# Altium schematic sheet AI_CONN.SchDoc
size C portrait; SheetNumber: 5; SheetTotal: 5
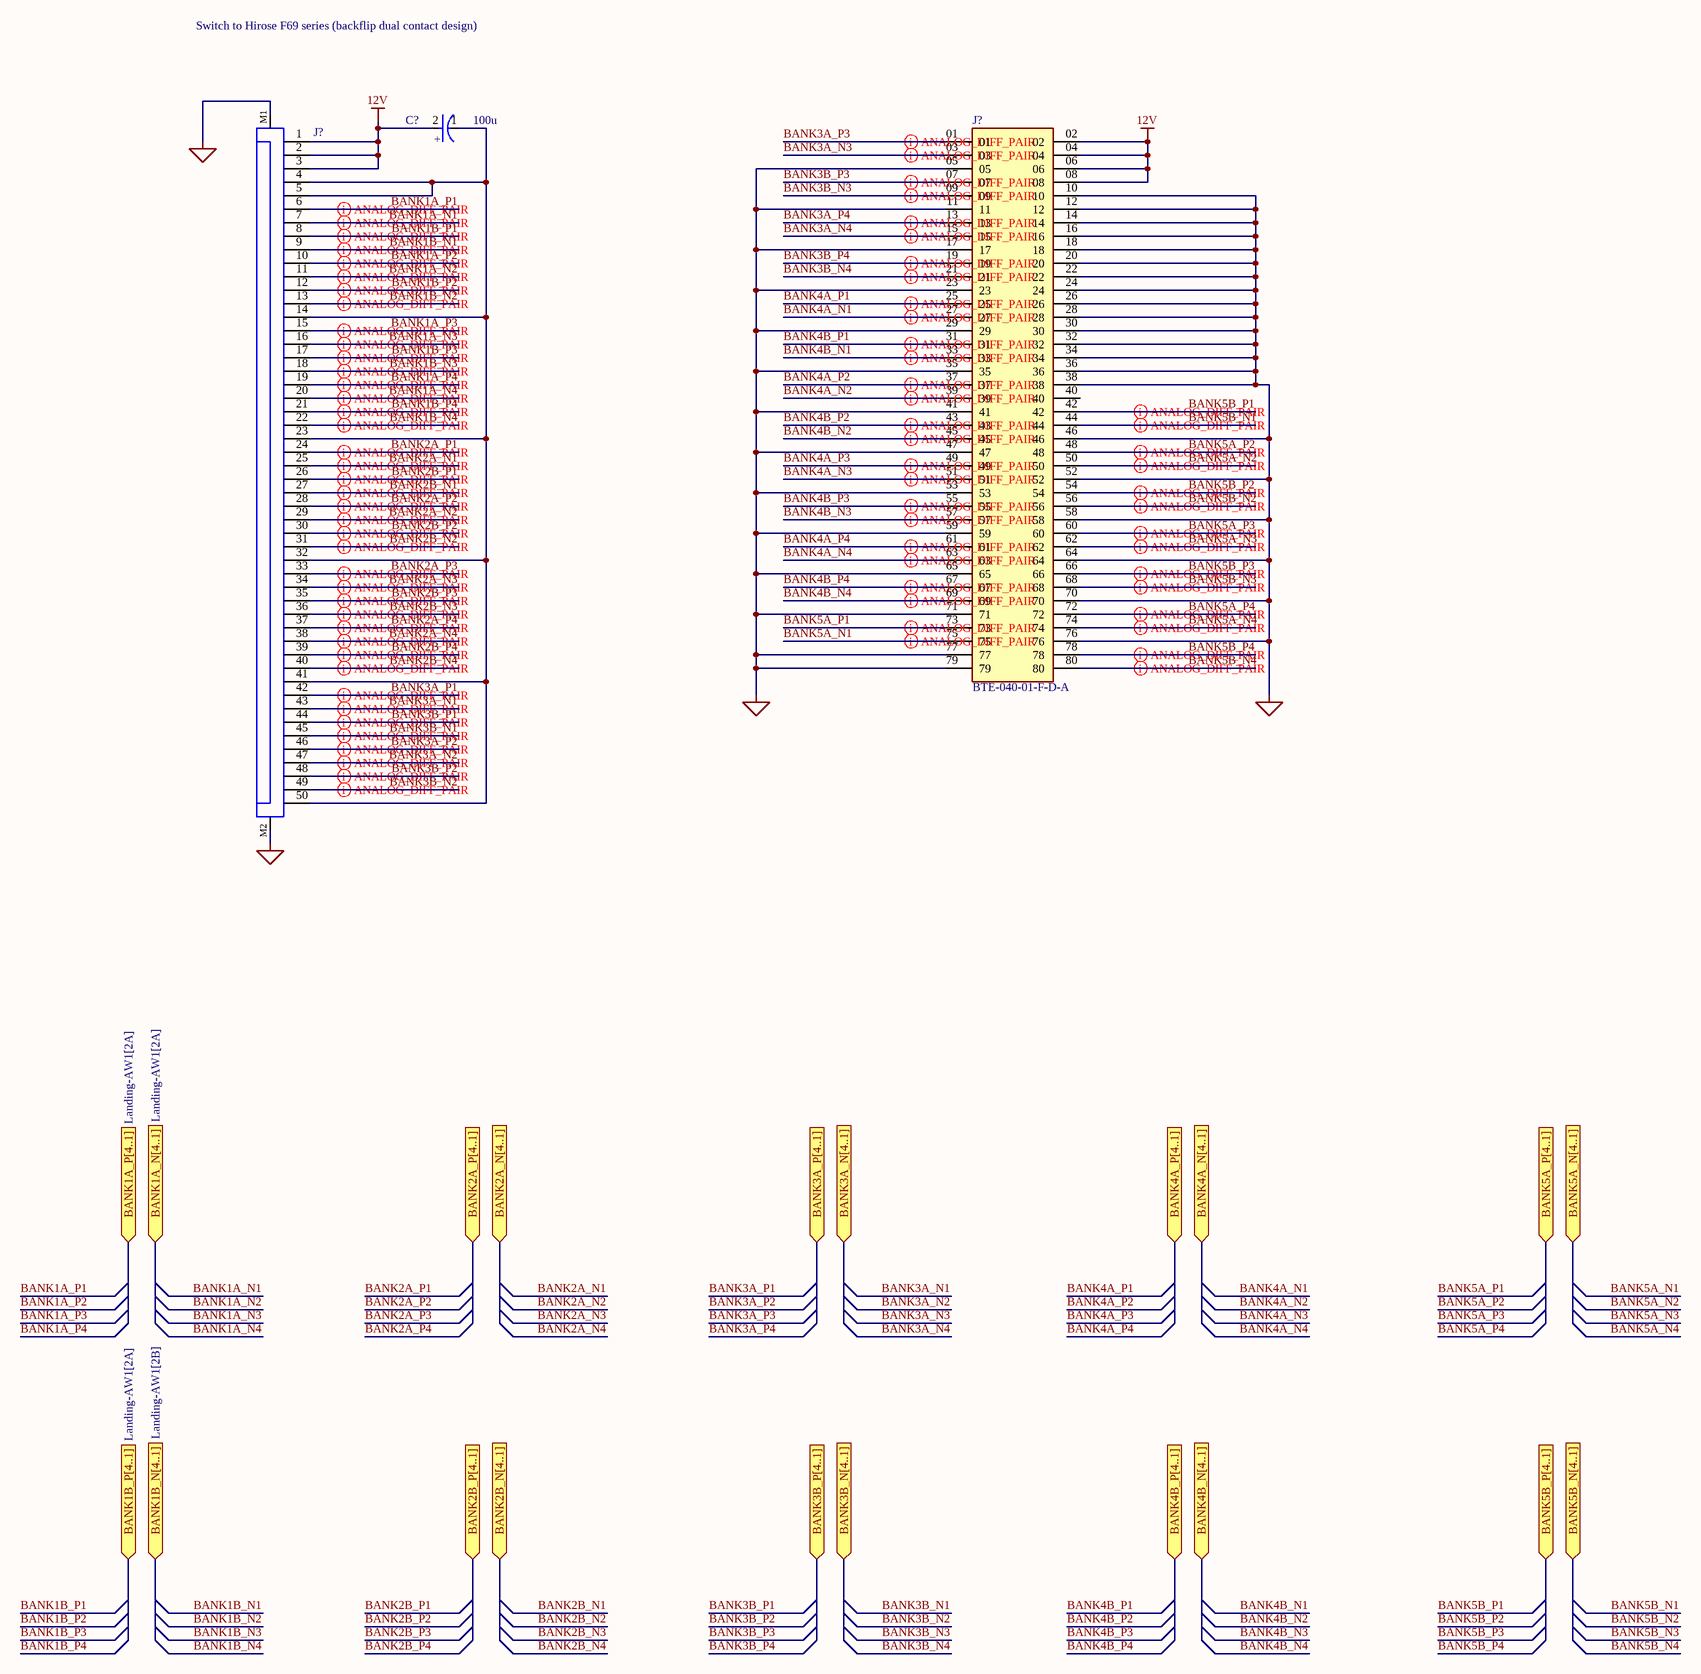
[diagram p0: AI_CONN.SchDoc]

## Parts
(Parts that share a designator on the sheet are numbered #1, #2 ... from top to bottom, then left to right.)
C?  100u  [FP-T521X-MFG]
J?#1  68715014522  [68715014522]  (value not drawn)
J?#2  BTE-040-01-F-D-A  [BTE-040]

## Ports
BANK1A_N[4..1] (in, see Landing-AW1[2A]), BANK1A_P[4..1] (in, see Landing-AW1[2A]), BANK1B_N[4..1] (in, see Landing-AW1[2B]), BANK1B_P[4..1] (in, see Landing-AW1[2A]), BANK2A_N[4..1] (in), BANK2A_P[4..1] (in), BANK2B_N[4..1] (in), BANK2B_P[4..1] (in), BANK3A_N[4..1] (in), BANK3A_P[4..1] (in), BANK3B_N[4..1] (in), BANK3B_P[4..1] (in), BANK4A_N[4..1] (in), BANK4A_P[4..1] (in), BANK4B_N[4..1] (in), BANK4B_P[4..1] (in), BANK5A_N[4..1] (in), BANK5A_P[4..1] (in), BANK5B_N[4..1] (in), BANK5B_P[4..1] (in)

## Nets
12V: C?.2(A) J?#1.1 J?#1.2 J?#1.3 J?#2.02 J?#2.04 J?#2.06 J?#2.08
GND: J?#1.M1 J?#1.M2 J?#2.05 J?#2.10 J?#2.11 J?#2.12 J?#2.14 J?#2.16 J?#2.17 J?#2.18 J?#2.20 J?#2.22 J?#2.23 J?#2.24 J?#2.26 J?#2.28 J?#2.29 J?#2.30 J?#2.32 J?#2.34 J?#2.35 J?#2.36 J?#2.38 J?#2.41 J?#2.46 J?#2.47 J?#2.52 J?#2.53 J?#2.58 J?#2.59 J?#2.64 J?#2.65 J?#2.70 J?#2.71 J?#2.76 J?#2.77 J?#2.79
BANK1A_N1: J?#1.7
BANK1A_N2: J?#1.11
BANK1A_N3: J?#1.16
BANK1A_N4: J?#1.20
BANK1A_P1: J?#1.6
BANK1A_P2: J?#1.10
BANK1A_P3: J?#1.15
BANK1A_P4: J?#1.19
BANK1B_N1: J?#1.9
BANK1B_N2: J?#1.13
BANK1B_N3: J?#1.18
BANK1B_N4: J?#1.22
BANK1B_P1: J?#1.8
BANK1B_P2: J?#1.12
BANK1B_P3: J?#1.17
BANK1B_P4: J?#1.21
BANK2A_N1: J?#1.25
BANK2A_N2: J?#1.29
BANK2A_N3: J?#1.34
BANK2A_N4: J?#1.38
BANK2A_P1: J?#1.24
BANK2A_P2: J?#1.28
BANK2A_P3: J?#1.33
BANK2A_P4: J?#1.37
BANK2B_N1: J?#1.27
BANK2B_N2: J?#1.31
BANK2B_N3: J?#1.36
BANK2B_N4: J?#1.40
BANK2B_P1: J?#1.26
BANK2B_P2: J?#1.30
BANK2B_P3: J?#1.35
BANK2B_P4: J?#1.39
BANK3A_N1: J?#1.43
BANK3A_N2: J?#1.47
BANK3A_N3: J?#2.03
BANK3A_N4: J?#2.15
BANK3A_P1: J?#1.42
BANK3A_P2: J?#1.46
BANK3A_P3: J?#2.01
BANK3A_P4: J?#2.13
BANK3B_N1: J?#1.45
BANK3B_N2: J?#1.49
BANK3B_N3: J?#2.09
BANK3B_N4: J?#2.21
BANK3B_P1: J?#1.44
BANK3B_P2: J?#1.48
BANK3B_P3: J?#2.07
BANK3B_P4: J?#2.19
BANK4A_N1: J?#2.27
BANK4A_N2: J?#2.39
BANK4A_N3: J?#2.51
BANK4A_N4: J?#2.63
BANK4A_P1: J?#2.25
BANK4A_P2: J?#2.37
BANK4A_P3: J?#2.49
BANK4A_P4: J?#2.61
BANK4B_N1: J?#2.33
BANK4B_N2: J?#2.45
BANK4B_N3: J?#2.57
BANK4B_N4: J?#2.69
BANK4B_P1: J?#2.31
BANK4B_P2: J?#2.43
BANK4B_P3: J?#2.55
BANK4B_P4: J?#2.67
BANK5A_N1: J?#2.75
BANK5A_N2: J?#2.50
BANK5A_N3: J?#2.62
BANK5A_N4: J?#2.74
BANK5A_P1: J?#2.73
BANK5A_P2: J?#2.48
BANK5A_P3: J?#2.60
BANK5A_P4: J?#2.72
BANK5B_N1: J?#2.44
BANK5B_N2: J?#2.56
BANK5B_N3: J?#2.68
BANK5B_N4: J?#2.80
BANK5B_P1: J?#2.42
BANK5B_P2: J?#2.54
BANK5B_P3: J?#2.66
BANK5B_P4: J?#2.78
NetC?_1: C?.1(C) J?#1.4 J?#1.5 J?#1.14 J?#1.23 J?#1.32 J?#1.41 J?#1.50

Not connected (* = marked no-connect by the designer): J?#2 40

## Layout directives
differential pair: BANK1A_N1, BANK1A_N2, BANK1A_N3, BANK1A_N4, BANK1A_P1, BANK1A_P2, BANK1A_P3, BANK1A_P4, BANK1B_N1, BANK1B_N2, BANK1B_N3, BANK1B_N4, BANK1B_P1, BANK1B_P2, BANK1B_P3, BANK1B_P4, BANK2A_N1, BANK2A_N2, BANK2A_N3, BANK2A_N4, BANK2A_P1, BANK2A_P2, BANK2A_P3, BANK2A_P4, BANK2B_N1, BANK2B_N2, BANK2B_N3, BANK2B_N4, BANK2B_P1, BANK2B_P2, BANK2B_P3, BANK2B_P4, BANK3A_N1, BANK3A_N2, BANK3A_N3, BANK3A_N4, BANK3A_P1, BANK3A_P2, BANK3A_P3, BANK3A_P4, BANK3B_N1, BANK3B_N2, BANK3B_N3, BANK3B_N4, BANK3B_P1, BANK3B_P2, BANK3B_P3, BANK3B_P4, BANK4A_N1, BANK4A_N2, BANK4A_N3, BANK4A_N4, BANK4A_P1, BANK4A_P2, BANK4A_P3, BANK4A_P4, BANK4B_N1, BANK4B_N2, BANK4B_N3, BANK4B_N4, BANK4B_P1, BANK4B_P2, BANK4B_P3, BANK4B_P4, BANK5A_N1, BANK5A_N2, BANK5A_N3, BANK5A_N4, BANK5A_P1, BANK5A_P2, BANK5A_P3, BANK5A_P4, BANK5B_N1, BANK5B_N2, BANK5B_N3, BANK5B_N4, BANK5B_P1, BANK5B_P2, BANK5B_P3, BANK5B_P4

## Notes on the sheet
- Switch to Hirose F69 series (backflip dual contact design)
- (in symbol CMP-03017-000004-1) +

## Library data of the parts
C? = CMP-03017-000004-1: CAP TANT POLY 100UF 25V 2917 / T521X107M025ATE060; Polarity: Polar; Tolerance: 20%; Life (Hours): 2000Hour; ESR (Equivalent Series Resistance): 60mR; Dissipation Factor: 10%; Voltage Rating (DC): 25V; Features: General Purpose; Length: 7.3mm; Case/Package: 2917; Max Operating Temperature: 105°C; Construction: Flat; Capacitance: 100uF; Min Operating Temperature: -55°C; Package Quantity: 1; RoHS Compliant: Yes; Height: 4mm; Depth: 4.3mm; REACH SVHC: No SVHC; Termination: SMD/SMT; Width: 4.3mm; Case Code (Metric): 7343; Height - Seated (Max): 0.169inch; Case Code (Imperial): 2917; Radiation Hardening: No; Voltage Rating: 25V; Mount: Surface Mount; Packaging: Tape and Reel; Series: KO-CAP T521
J?#1 = 68715014522: WR-FPC SMT ZIF Horizontal Bottom Contact, pitch 0.5mm, Horizontal, 50pins; Manufacturer: Wurth Elektronik; Contact Resistance: 20mΩ; Rated Current: 0.5A; Working Voltage: 50VAC; ComponentLink1Description: Website Link; ComponentLink1URL: https://www.we-online.com/redexpert/article/68715014522?ad; ComponentLink2Description: Datasheet Link; ComponentLink2URL: https://www.we-online.com/redexpert/spec/68715014522?ad; Manufacturer Part Number: 68715014522; Category: FPC Connectors; Match Code: WR-FPC; Mount: Surface Mount; Operating Temperature Max: 85°C; Operating Temperature Min: -25°C; Packaging: Tape and Reel; Length: 31.4mm; Width: 5.1mm; Height: 2.1mm; Number of Pins: 50; Orientation: Horizontal; Pitch: 0.5mm
J?#2 = BTE-040-01-F-D-A: MF: Samtec; MP: BTE-040-01-F-D-A; Value: *; Package: None; Price: None; Availability: Unavailable